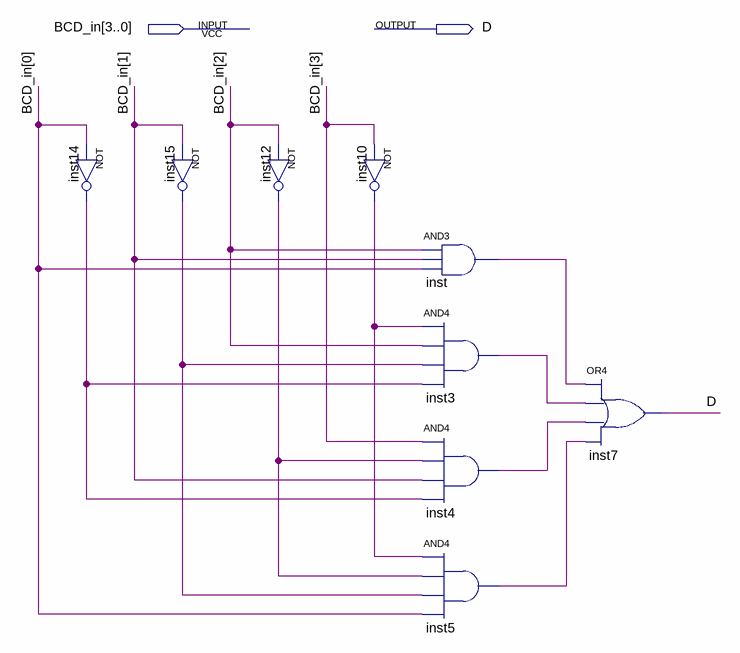
[diagram p0: schematic sheet]
// Quartus schematic D.bdf as structural Verilog: 9 symbols, 2 pins
module D (
  input  [3:0] BCD_in,
  output D
);

  wire inst3_out, inst4_out, inst5_out, inst10_out, inst12_out, inst14_out, inst15_out, inst_out;

  not inst14 (inst14_out, BCD_in[0]);
  not inst15 (inst15_out, BCD_in[1]);
  not inst12 (inst12_out, BCD_in[2]);
  not inst10 (inst10_out, BCD_in[3]);
  and inst (inst_out, BCD_in[2], BCD_in[1], BCD_in[0]);
  and inst3 (inst3_out, inst10_out, BCD_in[2], inst15_out, inst14_out);
  and inst4 (inst4_out, BCD_in[3], inst12_out, BCD_in[1], inst14_out);
  and inst5 (inst5_out, inst10_out, inst12_out, inst15_out, BCD_in[0]);
  or inst7 (D, inst_out, inst3_out, inst4_out, inst5_out);
endmodule
